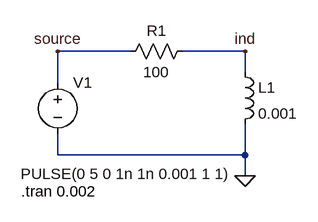
[diagram p0: schematic electronics_pulse_into_indictor.asc]
electronics_pulse_into_indictor.asc, the LTspice schematic file:
Version 4
SHEET 1 880 680
WIRE 144 64 32 64
WIRE 320 64 224 64
WIRE 320 96 320 64
WIRE 32 112 32 64
WIRE 32 224 32 192
WIRE 320 224 320 176
WIRE 320 224 32 224
WIRE 320 256 320 224
FLAG 320 256 0
FLAG 32 64 source
FLAG 320 64 ind
SYMBOL voltage 32 96 R0
WINDOW 123 0 0 Left 0
WINDOW 39 0 0 Left 0
WINDOW 3 -57 157 Left 2
SYMATTR Value PULSE(0 5 0 1n 1n 0.001 1 1)
SYMATTR InstName V1
SYMBOL res 128 80 R270
WINDOW 0 32 56 VTop 2
WINDOW 3 0 56 VBottom 2
SYMATTR InstName R1
SYMATTR Value 100
SYMBOL ind 304 80 R0
SYMATTR InstName L1
SYMATTR Value 0.001
TEXT -24 280 Left 2 !.tran 0.002

The netlist it stands for:
* electronics_pulse_into_indictor.asc
V1 source 0 PULSE(0 5 0 1n 1n 0.001 1 1)
R1 source ind 100
L1 ind 0 0.001
.tran 0.002
.backanno
.end